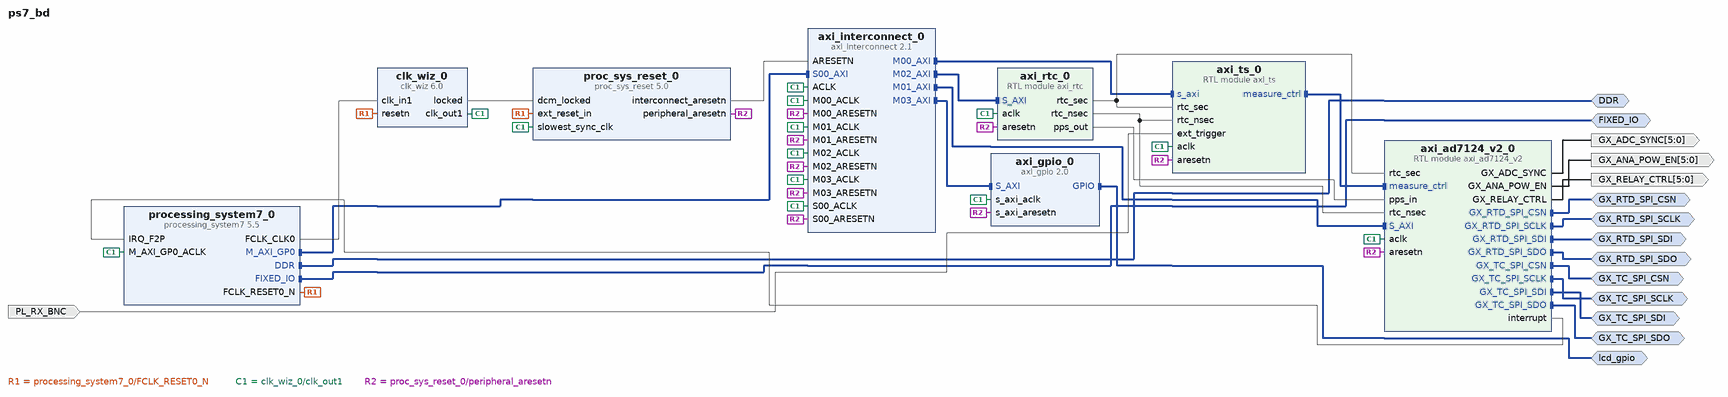
[diagram p0: block diagram of the top level]
# Vivado block design ps7_bd, xc7z020clg484-2, Vivado 2020.1
create_bd_design ps7_bd

create_bd_intf_port -mode Master -vlnv xilinx.com:interface:ddrx_rtl:1.0 DDR
create_bd_intf_port -mode Master -vlnv xilinx.com:display_processing_system7:fixedio_rtl:1.0 FIXED_IO
create_bd_intf_port -mode Master -vlnv xilinx.com:interface:gpio_rtl:1.0 GX_RTD_SPI_CSN
create_bd_intf_port -mode Master -vlnv xilinx.com:interface:gpio_rtl:1.0 GX_RTD_SPI_SCLK
create_bd_intf_port -mode Master -vlnv xilinx.com:interface:gpio_rtl:1.0 GX_RTD_SPI_SDI
create_bd_intf_port -mode Master -vlnv xilinx.com:interface:gpio_rtl:1.0 GX_RTD_SPI_SDO
create_bd_intf_port -mode Master -vlnv xilinx.com:interface:gpio_rtl:1.0 GX_TC_SPI_SCLK
create_bd_intf_port -mode Master -vlnv xilinx.com:interface:gpio_rtl:1.0 GX_TC_SPI_SDI
create_bd_intf_port -mode Master -vlnv xilinx.com:interface:gpio_rtl:1.0 GX_TC_SPI_SDO
create_bd_intf_port -mode Master -vlnv xilinx.com:interface:gpio_rtl:1.0 GX_TC_SPI_CSN
create_bd_intf_port -mode Master -vlnv xilinx.com:interface:gpio_rtl:1.0 lcd_gpio
create_bd_port -dir O -from 5 -to 0 GX_ADC_SYNC
create_bd_port -dir O -from 5 -to 0 GX_ANA_POW_EN
create_bd_port -dir O -from 5 -to 0 GX_RELAY_CTRL
create_bd_port -dir I PL_RX_BNC

create_bd_cell -type ip -vlnv xilinx.com:ip:processing_system7:5.5 processing_system7_0
set_property -dict [list \
  CONFIG.PCW_APU_PERIPHERAL_FREQMHZ 666.666666 \
  CONFIG.PCW_CPU_CPU_6X4X_MAX_RANGE 767 \
  CONFIG.PCW_ENET0_ENET0_IO {MIO 16 .. 27} \
  CONFIG.PCW_ENET0_GRP_MDIO_ENABLE 1 \
  CONFIG.PCW_ENET0_GRP_MDIO_IO {MIO 52 .. 53} \
  CONFIG.PCW_ENET0_PERIPHERAL_ENABLE 1 \
  CONFIG.PCW_ENET_RESET_ENABLE 0 \
  CONFIG.PCW_FPGA0_PERIPHERAL_FREQMHZ 50 \
  CONFIG.PCW_FPGA1_PERIPHERAL_FREQMHZ 50 \
  CONFIG.PCW_GPIO_MIO_GPIO_ENABLE 1 \
  CONFIG.PCW_GPIO_MIO_GPIO_IO MIO \
  CONFIG.PCW_I2C_RESET_ENABLE 0 \
  CONFIG.PCW_IRQ_F2P_INTR 1 \
  CONFIG.PCW_PERIPHERAL_BOARD_PRESET None \
  CONFIG.PCW_PRESET_BANK1_VOLTAGE {LVCMOS 1.8V} \
  CONFIG.PCW_QSPI_GRP_SINGLE_SS_ENABLE 1 \
  CONFIG.PCW_QSPI_GRP_SINGLE_SS_IO {MIO 1 .. 6} \
  CONFIG.PCW_QSPI_PERIPHERAL_ENABLE 1 \
  CONFIG.PCW_QSPI_QSPI_IO {MIO 1 .. 6} \
  CONFIG.PCW_SD0_GRP_CD_ENABLE 0 \
  CONFIG.PCW_SD0_GRP_WP_ENABLE 0 \
  CONFIG.PCW_SD0_PERIPHERAL_ENABLE 1 \
  CONFIG.PCW_SD0_SD0_IO {MIO 40 .. 45} \
  CONFIG.PCW_SDIO_PERIPHERAL_FREQMHZ 100 \
  CONFIG.PCW_SINGLE_QSPI_DATA_MODE x4 \
  CONFIG.PCW_UART0_PERIPHERAL_ENABLE 1 \
  CONFIG.PCW_UART0_UART0_IO {MIO 10 .. 11} \
  CONFIG.PCW_UART1_PERIPHERAL_ENABLE 0 \
  CONFIG.PCW_UART_PERIPHERAL_FREQMHZ 100 \
  CONFIG.PCW_UIPARAM_DDR_FREQ_MHZ 400 \
  CONFIG.PCW_UIPARAM_DDR_MEMORY_TYPE {DDR 3 (Low Voltage)} \
  CONFIG.PCW_UIPARAM_DDR_PARTNO {MT41K256M16 RE-125} \
  CONFIG.PCW_USB0_PERIPHERAL_ENABLE 0 \
  CONFIG.PCW_USB_RESET_ENABLE 0 \
  CONFIG.PCW_USE_FABRIC_INTERRUPT 1 \
] [get_bd_cells processing_system7_0]
# 508 more settings of processing_system7_0 are not shown: defaults, MIO pin electricals, DDR timing, and values the tool derives
create_bd_cell -type ip -vlnv xilinx.com:ip:clk_wiz:6.0 clk_wiz_0
set_property -dict [list \
  CONFIG.CLKOUT1_JITTER 154.207 \
  CONFIG.CLKOUT1_REQUESTED_OUT_FREQ 125 \
  CONFIG.MMCM_CLKOUT0_DIVIDE_F 8.000 \
  CONFIG.RESET_PORT resetn \
  CONFIG.RESET_TYPE ACTIVE_LOW \
] [get_bd_cells clk_wiz_0]
create_bd_cell -type ip -vlnv xilinx.com:ip:proc_sys_reset:5.0 proc_sys_reset_0
create_bd_cell -type ip -vlnv xilinx.com:ip:axi_interconnect:2.1 axi_interconnect_0
set_property -dict {CONFIG.NUM_MI 4 CONFIG.STRATEGY 1} [get_bd_cells axi_interconnect_0]
create_bd_cell -type ip -vlnv xilinx.com:ip:axi_gpio:2.0 axi_gpio_0
set_property -dict {CONFIG.C_GPIO_WIDTH 13} [get_bd_cells axi_gpio_0]
create_bd_cell -type module -reference axi_rtc axi_rtc_0
create_bd_cell -type module -reference axi_ad7124_v2 axi_ad7124_v2_0
create_bd_cell -type module -reference axi_ts axi_ts_0

# ---- connections ----

connect_bd_intf_net -intf_net axi_ad7124_v2_0_GX_TX_SPI_CSN [get_bd_intf_ports GX_TC_SPI_CSN] [get_bd_intf_pins axi_ad7124_v2_0/GX_TC_SPI_CSN]
connect_bd_intf_net [get_bd_intf_ports GX_TC_SPI_SDI] [get_bd_intf_pins axi_ad7124_v2_0/GX_TC_SPI_SDI]
connect_bd_intf_net [get_bd_intf_ports DDR] [get_bd_intf_pins processing_system7_0/DDR]
connect_bd_intf_net [get_bd_intf_pins axi_ad7124_v2_0/S_AXI] [get_bd_intf_pins axi_interconnect_0/M01_AXI]
connect_bd_intf_net [get_bd_intf_ports GX_TC_SPI_SDO] [get_bd_intf_pins axi_ad7124_v2_0/GX_TC_SPI_SDO]
connect_bd_intf_net [get_bd_intf_ports GX_RTD_SPI_SCLK] [get_bd_intf_pins axi_ad7124_v2_0/GX_RTD_SPI_SCLK]
connect_bd_intf_net [get_bd_intf_pins axi_rtc_0/S_AXI] [get_bd_intf_pins axi_interconnect_0/M02_AXI]
connect_bd_intf_net [get_bd_intf_ports lcd_gpio] [get_bd_intf_pins axi_gpio_0/GPIO]
connect_bd_intf_net [get_bd_intf_ports GX_RTD_SPI_SDO] [get_bd_intf_pins axi_ad7124_v2_0/GX_RTD_SPI_SDO]
connect_bd_intf_net [get_bd_intf_ports GX_RTD_SPI_SDI] [get_bd_intf_pins axi_ad7124_v2_0/GX_RTD_SPI_SDI]
connect_bd_intf_net [get_bd_intf_pins axi_interconnect_0/M03_AXI] [get_bd_intf_pins axi_gpio_0/S_AXI]
connect_bd_intf_net [get_bd_intf_ports GX_RTD_SPI_CSN] [get_bd_intf_pins axi_ad7124_v2_0/GX_RTD_SPI_CSN]
connect_bd_intf_net [get_bd_intf_ports GX_TC_SPI_SCLK] [get_bd_intf_pins axi_ad7124_v2_0/GX_TC_SPI_SCLK]
connect_bd_intf_net [get_bd_intf_ports FIXED_IO] [get_bd_intf_pins processing_system7_0/FIXED_IO]
connect_bd_intf_net [get_bd_intf_pins axi_ts_0/measure_ctrl] [get_bd_intf_pins axi_ad7124_v2_0/measure_ctrl]
connect_bd_intf_net [get_bd_intf_pins axi_interconnect_0/M00_AXI] [get_bd_intf_pins axi_ts_0/s_axi]
connect_bd_intf_net [get_bd_intf_pins processing_system7_0/M_AXI_GP0] [get_bd_intf_pins axi_interconnect_0/S00_AXI]
connect_bd_net [get_bd_pins processing_system7_0/FCLK_CLK0] [get_bd_pins clk_wiz_0/clk_in1]
connect_bd_net [get_bd_pins processing_system7_0/FCLK_RESET0_N] [get_bd_pins clk_wiz_0/resetn] [get_bd_pins proc_sys_reset_0/ext_reset_in]
connect_bd_net [get_bd_pins clk_wiz_0/clk_out1] \
  [get_bd_pins processing_system7_0/M_AXI_GP0_ACLK] [get_bd_pins proc_sys_reset_0/slowest_sync_clk] \
  [get_bd_pins axi_interconnect_0/ACLK] [get_bd_pins axi_interconnect_0/S00_ACLK] [get_bd_pins axi_interconnect_0/M00_ACLK] \
  [get_bd_pins axi_interconnect_0/M01_ACLK] [get_bd_pins axi_interconnect_0/M02_ACLK] \
  [get_bd_pins axi_interconnect_0/M03_ACLK] [get_bd_pins axi_gpio_0/s_axi_aclk] [get_bd_pins axi_rtc_0/aclk] \
  [get_bd_pins axi_ad7124_v2_0/aclk] [get_bd_pins axi_ts_0/aclk]
connect_bd_net [get_bd_pins clk_wiz_0/locked] [get_bd_pins proc_sys_reset_0/dcm_locked]
connect_bd_net -net S00_ARESETN_1 [get_bd_pins proc_sys_reset_0/peripheral_aresetn] \
  [get_bd_pins axi_interconnect_0/M03_ARESETN] [get_bd_pins axi_interconnect_0/M02_ARESETN] \
  [get_bd_pins axi_interconnect_0/M01_ARESETN] [get_bd_pins axi_interconnect_0/M00_ARESETN] \
  [get_bd_pins axi_interconnect_0/S00_ARESETN] [get_bd_pins axi_gpio_0/s_axi_aresetn] [get_bd_pins axi_rtc_0/aresetn] \
  [get_bd_pins axi_ad7124_v2_0/aresetn] [get_bd_pins axi_ts_0/aresetn]
connect_bd_net [get_bd_pins axi_ad7124_v2_0/interrupt] [get_bd_pins processing_system7_0/IRQ_F2P]
connect_bd_net [get_bd_pins axi_ad7124_v2_0/GX_ADC_SYNC] [get_bd_ports GX_ADC_SYNC]
connect_bd_net [get_bd_pins axi_ad7124_v2_0/GX_ANA_POW_EN] [get_bd_ports GX_ANA_POW_EN]
connect_bd_net [get_bd_pins axi_ad7124_v2_0/GX_RELAY_CTRL] [get_bd_ports GX_RELAY_CTRL]
connect_bd_net -net ARESETN_1 [get_bd_pins proc_sys_reset_0/interconnect_aresetn] [get_bd_pins axi_interconnect_0/ARESETN]
connect_bd_net [get_bd_pins axi_rtc_0/pps_out] [get_bd_pins axi_ad7124_v2_0/pps_in]
connect_bd_net [get_bd_pins axi_rtc_0/rtc_sec] [get_bd_pins axi_ad7124_v2_0/rtc_sec] [get_bd_pins axi_ts_0/rtc_sec]
connect_bd_net [get_bd_pins axi_rtc_0/rtc_nsec] [get_bd_pins axi_ad7124_v2_0/rtc_nsec] [get_bd_pins axi_ts_0/rtc_nsec]
connect_bd_net -net ext_trigger_0_1 [get_bd_ports PL_RX_BNC] [get_bd_pins axi_ts_0/ext_trigger]
set_property HDL_ATTRIBUTE.BMM_INFO_PROCESSOR {arm > ps7_bd axi_bram_ctrl_0} [get_bd_cells processing_system7_0]
set_property HDL_ATTRIBUTE.KEEP_HIERARCHY yes [get_bd_cells processing_system7_0]

# ---- address map ----
assign_bd_address -offset 0x40000000 -range 64K -target_address_space [get_bd_addr_spaces processing_system7_0/Data] [get_bd_addr_segs axi_ts_0/s_axi/reg0]
assign_bd_address -offset 0x40010000 -range 64K -target_address_space [get_bd_addr_spaces processing_system7_0/Data] [get_bd_addr_segs axi_ad7124_v2_0/S_AXI/reg0]
assign_bd_address -offset 0x40020000 -range 64K -target_address_space [get_bd_addr_spaces processing_system7_0/Data] [get_bd_addr_segs axi_rtc_0/S_AXI/reg0]
assign_bd_address -offset 0x40030000 -range 64K -target_address_space [get_bd_addr_spaces processing_system7_0/Data] [get_bd_addr_segs axi_gpio_0/S_AXI/Reg]

validate_bd_design
save_bd_design
